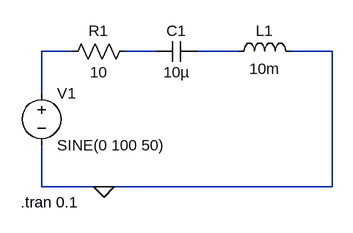
[diagram p0: schematic Draft2.asc]
Draft2.asc, the LTspice schematic file:
Version 4
SHEET 1 880 680
WIRE 80 96 32 96
WIRE 208 96 160 96
WIRE 336 96 272 96
WIRE 480 96 416 96
WIRE 32 160 32 96
WIRE 32 304 32 240
WIRE 128 304 32 304
WIRE 480 304 480 96
WIRE 480 304 128 304
FLAG 128 304 0
SYMBOL voltage 32 144 R0
WINDOW 123 0 0 Left 2
WINDOW 39 0 0 Left 2
SYMATTR InstName V1
SYMATTR Value SINE(0 100 50)
SYMBOL res 176 80 R90
WINDOW 0 0 56 VBottom 2
WINDOW 3 32 56 VTop 2
SYMATTR InstName R1
SYMATTR Value 10
SYMBOL cap 272 80 R90
WINDOW 0 0 32 VBottom 2
WINDOW 3 32 32 VTop 2
SYMATTR InstName C1
SYMATTR Value 10µ
SYMBOL ind 320 112 R270
WINDOW 0 32 56 VTop 2
WINDOW 3 5 56 VBottom 2
SYMATTR InstName L1
SYMATTR Value 10m
TEXT 0 328 Left 2 !.tran 0.1

The netlist it stands for:
* Draft2.asc
V1 N001 0 SINE(0 100 50)
R1 N002 N001 10
C1 N003 N002 10µ
L1 N003 0 10m
.tran 0.1
.backanno
.end